# EAGLE design digital-ps (EAGLE 9.6.2)
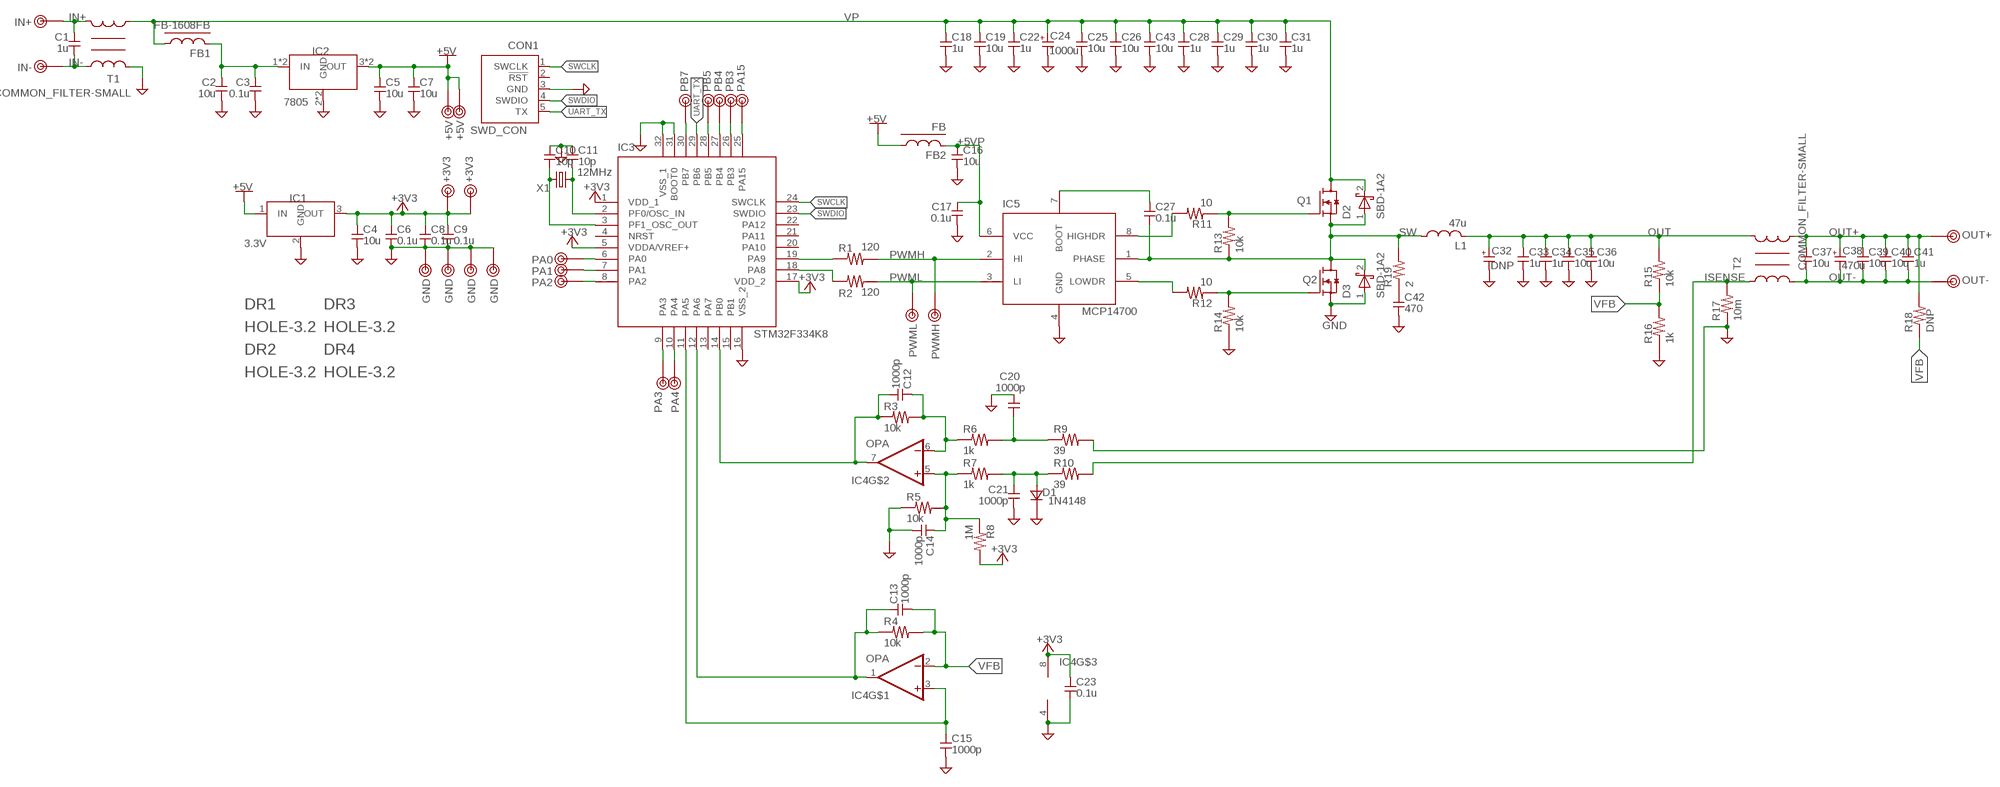
[diagram p0: schematic, sheet 1]

## Parts
C1  1u  C-2012-2  [2012-2]
C2  10u  C-3216  [3216]
C3  0.1u  C-1608  [1608]
C4  10u  C-2012  [2012]
C5  10u  C-2012  [2012]
C6  0.1u  C-1608  [1608]
C7  10u  C-2012  [2012]
C8  0.1u  C-1608  [1608]
C9  0.1u  C-1608  [1608]
C10  10p  C-1608  [1608]
C11  10p  C-1608  [1608]
C12  1000p  C-1608  [1608]
C13  1000p  C-1608  [1608]
C14  1000p  C-1608  [1608]
C15  1000p  C-1608  [1608]
C16  10u  C-2012  [2012]
C17  0.1u  C-1608  [1608]
C18  1u  C-1608-2  [1608-2]
C19  10u  C-3225-2  [3225-2]
C20  1000p  C-1608  [1608]
C21  1000p  C-1608  [1608]
C22  1u  C-1608-2  [1608-2]
C23  0.1u  C-1608  [1608]
C24  1000u  CPOLE5-13  [E5-13]
C25  10u  C-3225-2  [3225-2]
C26  10u  C-3225-2  [3225-2]
C27  0.1u  C-1608  [1608]
C28  1u  C-1608-2  [1608-2]
C29  1u  C-1608-2  [1608-2]
C30  1u  C-1608-2  [1608-2]
C31  1u  C-1608-2  [1608-2]
C32  DNP  CPOLE5-13  [E5-13]
C33  1u  C-1608-2  [1608-2]
C34  1u  C-1608-2  [1608-2]
C35  10u  C-3225-2  [3225-2]
C36  10u  C-3225-2  [3225-2]
C37  10u  C-3225-2  [3225-2]
C38  470u  CPOLE5-13  [E5-13]
C39  10u  C-3225-2  [3225-2]
C40  10u  C-3225-2  [3225-2]
C41  1u  C-1608-2  [1608-2]
C42  470  C-1608-2  [1608-2]
C43  10u  C-3225-2  [3225-2]
CON1  SWD_CON  [SWD_CON]
D1  1N4148  DIODE-1N4148W  [SOD123]
D2  SBD-1A2  [SOD123]
D3  SBD-1A2  [SOD123]
DR1  HOLE-3.2  [HOLE_3.2]
DR2  HOLE-3.2  [HOLE_3.2]
DR3  HOLE-3.2  [HOLE_3.2]
DR4  HOLE-3.2  [HOLE_3.2]
FB1  FB-1608FB  [1608-FB]
FB2  FB  [1608-J]
IC1  3.3V  78X-SOP  [P-HSIP3_2.30A]
IC2  7805  78X-3  [TO220-SOP-DUAL]
IC3  STM32F334K8  [TQFP32-08]
IC4  OPA  OPA-2-SOP  [SOP8]
IC5  MCP14700  [SOP8]
L1  47u  L-7  [L7-10]
Q1  EPC2052  NMOS-EPC2055  [EPC2055]
Q2  EPC2052  NMOS-EPC2055  [EPC2055]
R1  120  R-1608  [1608]
R2  120  R-1608  [1608]
R3  10k  R-1608  [1608]
R4  10k  R-1608  [1608]
R5  10k  R-1608  [1608]
R6  1k  R-1608  [1608]
R7  1k  R-1608  [1608]
R8  1M  R-1608  [1608]
R9  39  R-1608  [1608]
R10  39  R-1608  [1608]
R11  10  R-2012  [2012]
R12  10  R-2012  [2012]
R13  10k  R-2012  [2012]
R14  10k  R-2012  [2012]
R15  10k  R-1608  [1608]
R16  1k  R-1608  [1608]
R17  10m  R-6432  [6432]
R18  DNP  R-1608  [1608]
R19  2  R-1608-2  [1608-2]
T1  COMMON_FILTER-SMALL  [COMMON_FILTER__SMALL]
T2  COMMON_FILTER-SMALL  [COMMON_FILTER__SMALL]
TP1  PA0  TESTPIN  [TESTPIN]
TP2  PA1  TESTPIN  [TESTPIN]
TP3  PA2  TESTPIN  [TESTPIN]
TP4  PA3  TESTPIN  [TESTPIN]
TP5  IN+  TESTPIN-BIG  [TESTPIN-BIG]
TP6  IN-  TESTPIN-BIG  [TESTPIN-BIG]
TP7  OUT+  TESTPIN-BIG  [TESTPIN-BIG]
TP8  OUT-  TESTPIN-BIG  [TESTPIN-BIG]
TP9  PA4  TESTPIN  [TESTPIN]
TP10  PB7  TESTPIN  [TESTPIN]
TP11  PB5  TESTPIN  [TESTPIN]
TP15  +3V3  TESTPIN  [TESTPIN]
TP16  +5V  TESTPIN  [TESTPIN]
TP17  GND  TESTPIN  [TESTPIN]
TP18  GND  TESTPIN  [TESTPIN]
TP19  PWML  TESTPIN  [TESTPIN]
TP20  PWMH  TESTPIN  [TESTPIN]
TP21  PA15  TESTPIN  [TESTPIN]
TP22  PB3  TESTPIN  [TESTPIN]
TP23  PB4  TESTPIN  [TESTPIN]
TP24  +3V3  TESTPIN  [TESTPIN]
TP25  GND  TESTPIN  [TESTPIN]
TP26  +5V  TESTPIN  [TESTPIN]
TP27  GND  TESTPIN  [TESTPIN]
X1  12MHz  CRYSTALHC49S  [HC49/S]

## Nets
+3V3: C4.1 C6.1 C8.1 C9.1 C23.1 IC1.3(OUT) IC3.1(VDD_1) IC3.5(VDDA/VREF+) IC3.17(VDD_2) IC4.8(V+) R8.2 TP15.1 TP24.1
+5V: C5.1 C7.1 FB2.1 IC1.1(IN) IC2.3(OUT) IC2.6(OUT) TP16.1 TP26.1
+5VP: C16.1 C17.1 FB2.2 IC5.6(VCC)
GND: C2.2 C3.2 C4.2 C5.2 C6.2 C7.2 C8.2 C9.2 C10.1 C11.1 C14.2 C15.2 C16.2 C17.2 C18.2 C19.2 C20.1 C21.2 C22.2 C23.2 C24.- C25.2 C26.2 C28.2 C29.2 C30.2 C31.2 C32.- C33.2 C34.2 C35.2 C36.2 C42.2 C43.2 CON1.3(GND) D1.2(K) D3.1(A) IC1.2(GND) IC2.2(GND) IC2.5(GND) IC3.16(VSS_2) IC3.31(BOOT0) IC3.32(VSS_1) IC4.4(V-) IC5.4(GND) Q2.2(S) Q2.4(S) Q2.6(S) R5.1 R9.2 R14.1 R16.1 R17.1 T1.2 TP17.1 TP18.1 TP25.1 TP27.1
IN+: C1.1 T1.4 TP5.1
IN-: C1.2 T1.1 TP6.1
ISENSE: R10.2 R17.2 T2.1
N$1: IC3.18(PA8) R2.1
N$2: IC3.19(PA9) R1.1
N$3: C12.2 IC3.14(PB0) IC4.7(OUT) R3.1
N$4: C2.1 C3.1 FB1.2 IC2.1(IN) IC2.4(IN)
N$5: C14.1 IC4.5(+IN) R5.2 R7.1 R8.1
N$6: IC5.8(HIGHDR) R11.2
N$7: C27.1 IC5.7(BOOT)
N$8: C20.2 R6.2 R9.1
N$9: C42.1 R19.1
N$11: C21.1 D1.1(A) R7.2 R10.1
N$12: IC5.5(LOWDR) R12.2
N$13: IC3.9(PA3) TP4.1
N$14: IC3.10(PA4) TP9.1
N$15: IC3.6(PA0) TP1.1
N$16: IC3.7(PA1) TP2.1
N$17: IC3.8(PA2) TP3.1
N$18: IC3.30(PB7) TP10.1
N$19: IC3.28(PB5) TP11.1
N$23: IC3.27(PB4) TP23.1
N$24: C11.2 IC3.2(PF0/OSC_IN) X1.1
N$25: C10.2 IC3.3(PF1_OSC_OUT) X1.2
N$26: IC3.26(PB3) TP22.1
N$27: IC3.25(PA15) TP21.1
N$29: C12.1 IC4.6(-IN) R3.2 R6.1
N$30: C13.1 IC3.12(PA6) IC4.1(OUT) R4.1
N$31: C15.1 IC3.11(PA5) IC4.3(+IN)
N$32: Q1.1(G) R11.1 R13.2
N$33: Q2.1(G) R12.1 R14.2
OUT: C32.+ C33.1 C34.1 C35.1 C36.1 L1.2 R15.2 T2.4
OUT+: C37.1 C38.+ C39.1 C40.1 C41.1 R18.2 T2.3 TP7.1
OUT-: C37.2 C38.- C39.2 C40.2 C41.2 T2.2 TP8.1
PWMH: IC5.2(HI) R1.2 TP20.1
PWML: IC5.3(LI) R2.2 TP19.1
SW: C27.2 D2.1(A) D3.2(K) IC5.1(PHASE) L1.1 Q1.2(S) Q1.4(S) Q1.6(S) Q2.3(D) Q2.5(D) R13.1 R19.2
SWCLK: CON1.1(SWCLK) IC3.24(SWCLK)
SWDIO: CON1.4(SWDIO) IC3.23(SWDIO)
UART_TX: CON1.5(TX) IC3.29(PB6)
VFB: C13.2 IC4.2(-IN) R4.2 R15.1 R16.2 R18.1
VP: C18.1 C19.1 C22.1 C24.+ C25.1 C26.1 C28.1 C29.1 C30.1 C31.1 C43.1 D2.2(K) FB1.1 Q1.3(D) Q1.5(D) T1.3
Unconnected: CON1.2(!RST) IC3.4(NRST) IC3.13(PA7) IC3.15(PB1) IC3.20(PA10) IC3.21(PA11) IC3.22(PA12)

## Library data of the parts
C1-C23 C25-C31 C33-C37 C39-C43 = my_rcl:C
C24 C32 C38 = my_rcl:CPOL
CON1 = my_connector:SWD_CON
D1 = my_rcl:DIODE
D2 D3 = my_rcl:SBD
DR1-DR4 = my_connector:HOLE-3.2
FB1 FB2 = my_rcl:FB
IC1 IC2 = my_ic:78X
IC3 = my_ic:STM32F334K8
IC4 = my_ic:OPA-2
IC5 = my_ic:MCP14700
L1 = my_rcl:L
Q1 Q2 = my_ic:NMOS
R1-R19 = my_rcl:R
T1 T2 = my_rcl:COMMON_FILTER
TP1-TP11 TP15-TP27 = my_connector:TESTPIN
X1 = my_rcl:CRYSTAL: CRYSTAL

## Board
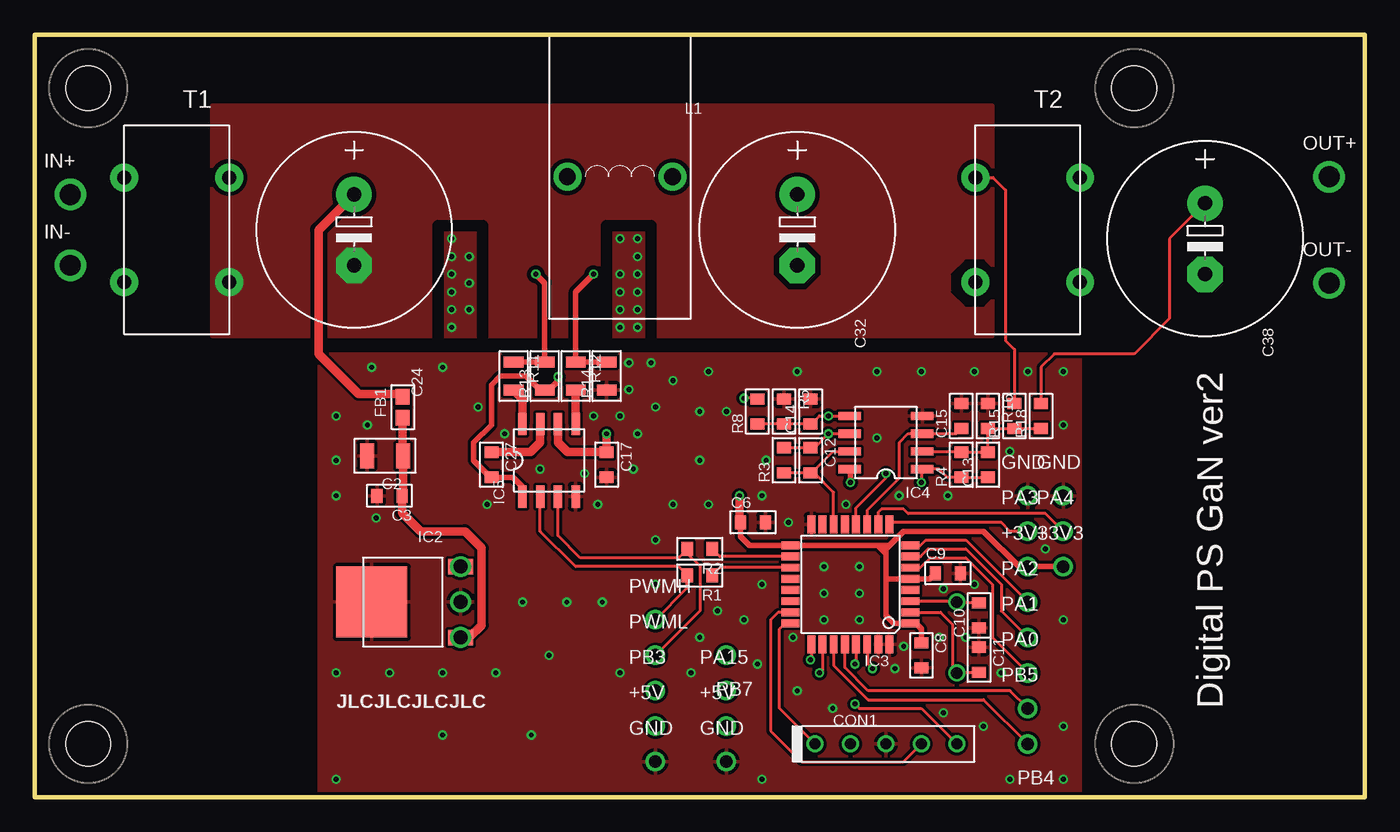
[diagram p1: board, top side]
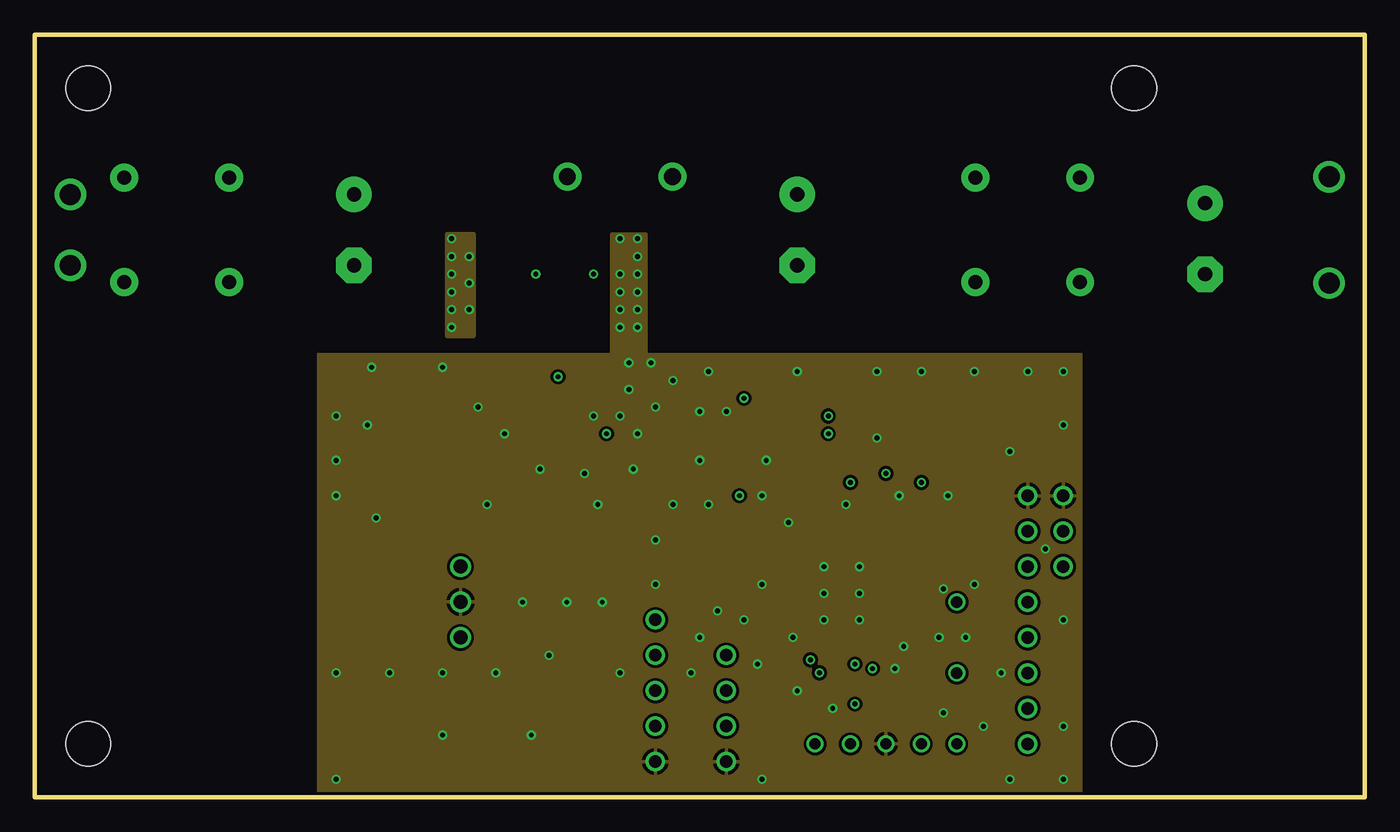
[diagram p2: board, inner layer Route2]
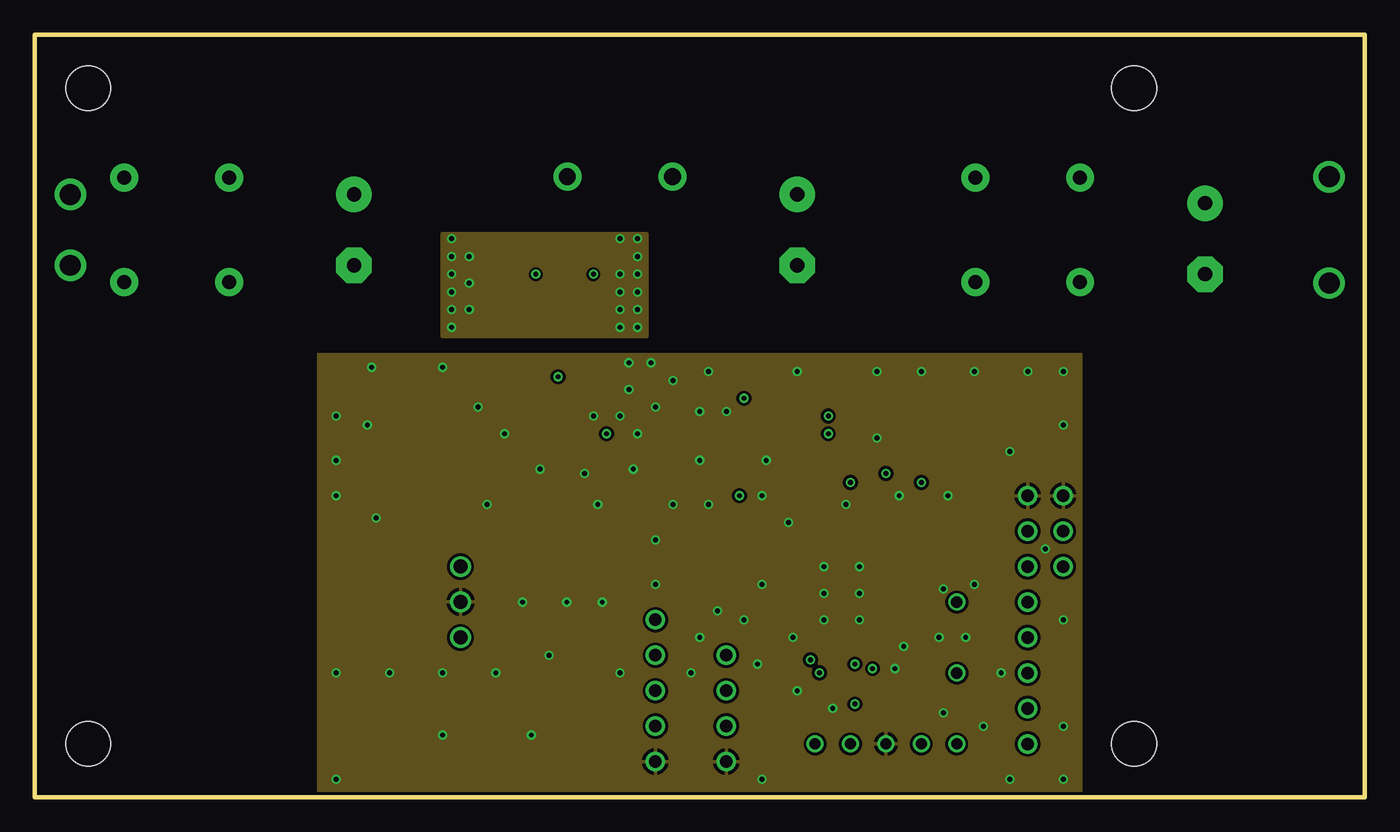
[diagram p3: board, inner layer Route15]
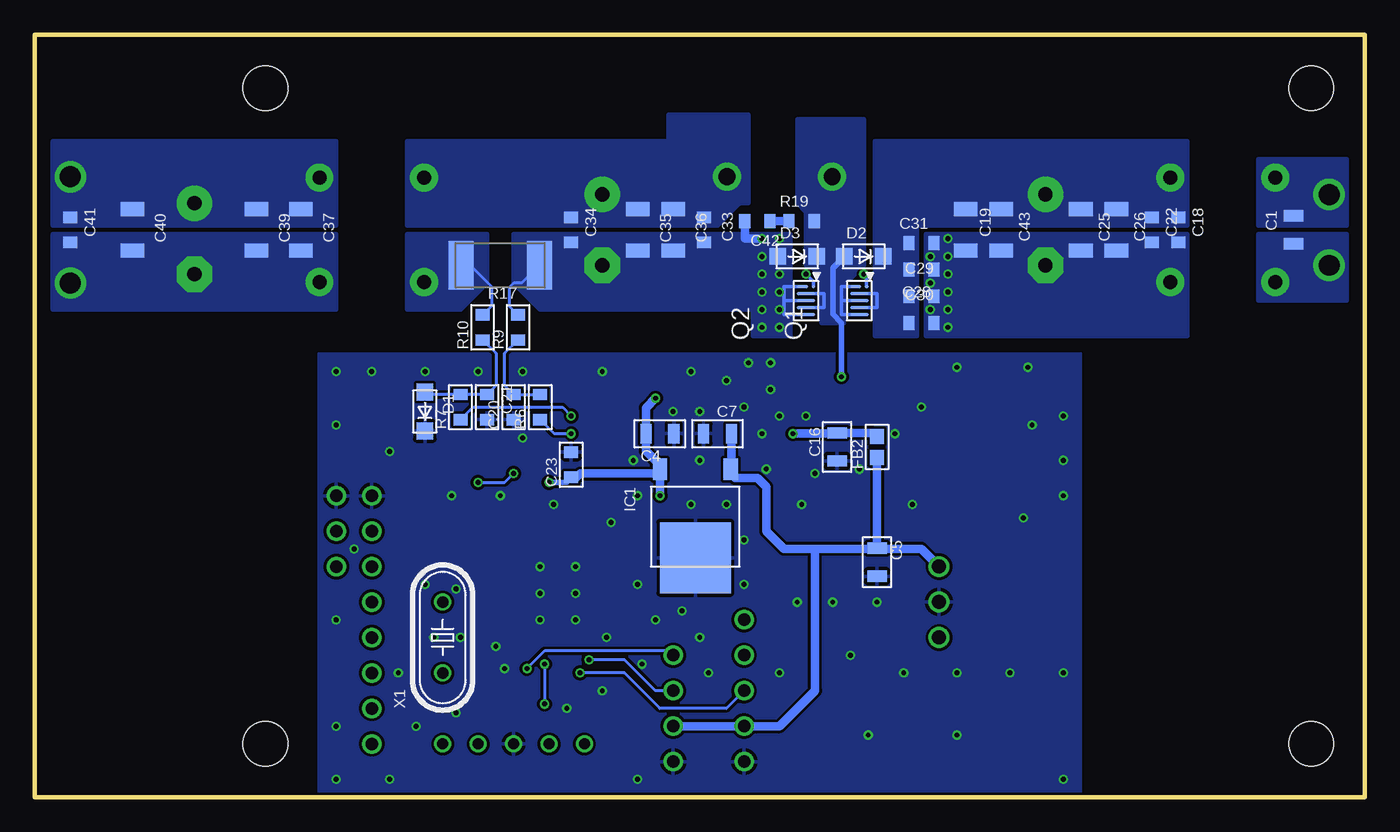
[diagram p4: board, bottom side, seen from below]

Size 95.25 x 54.61 mm. Coordinates in mm from the lower left corner, seen from the top.
Outline: 0,54.61 95.25,54.61 95.25,0 0,0 0,54.61
Copper layers (1*2*15*16): Top 0.035mm / dielectric 0.2mm / Route2 0.0175mm / dielectric 1.065mm / Route15 0.0175mm / dielectric 0.2mm / Bottom 0.035mm
Design rules "JLCPCB_4layer": minimum track width 6mil, minimum drill 0.3mm, track to track 6mil, track to pad 6mil, pad to pad 6mil, via to via 8mil, smd to smd 0mil, copper to edge 0.2mm, drill to drill 0.4mm, minimum pad ring 8mil, minimum via ring 6mil, stop-mask expansion 4mil, vias tented up to drill 1mm, thermal gap 10mil
tRestrict: 6 lines

### Footprints (pad centres in the part's own frame; a part is rotated, then mirrored left to right if it is on the bottom)
2012-2 = smd 0.8 x 1.4: 1 -1,0; 2 1,0
3216 = smd 1 x 1.8: 1 -1.3,0; 2 1.3,0
1608 = smd 0.8 x 1: 1 -0.9,0; 2 0.9,0
2012 = smd 0.8 x 1.4: 1 -1,0; 2 1,0
1608-2 = smd 0.8 x 1: 1 -0.9,0; 2 0.9,0
3225-2 = smd 1 x 1.7: 1 -1.5,0; 2 1.5,0
E5-13 = drill 1.016 pad 2.54: + -2.54,0 | drill 1.016 pad 2.54 octagon: - 2.54,0
SWD_CON = drill 0.8: 1 -5.08,0; 2 -2.54,0; 3 0,0; 4 2.54,0; 5 5.08,0
SOD123 = smd 1.2 x 1.2: 1 -1.4,0; 2 1.4,0
HOLE_3.2 = hole 3.2: 0,0
1608-FB = smd 1.1 x 1: 1 -0.75,0; 2 0.75,0
1608-J = smd 1.1 x 1: 1 -0.75,0; 2 0.75,0
P-HSIP3_2.30A = smd 1.016 x 1.524: 1 -2.54,0; 3 2.54,0 | smd 5.08 x 5.08: 2 0,6.35
TO220-SOP-DUAL = smd 1.1 x 1.8: 1 -2.54,0; 3 2.54,0 | smd 5.08 x 5.08: 2 0,6.35 | drill 1: 4 -2.54,0; 5 0,0; 6 2.54,0
TQFP32-08 = smd 1.27 x 0.559: 1 -4.293,2.8; 2 -4.293,2; 3 -4.293,1.2; 4 -4.293,0.4; 5 -4.293,-0.4; 6 -4.293,-1.2; 7 -4.293,-2; 8 -4.293,-2.8; 17 4.293,-2.8; 18 4.293,-2; 19 4.293,-1.2; 20 4.293,-0.4; 21 4.293,0.4; 22 4.293,1.2; 23 4.293,2; 24 4.293,2.8 | smd 0.559 x 1.27: 9 -2.8,-4.293; 10 -2,-4.293; 11 -1.2,-4.293; 12 -0.4,-4.293; 13 0.4,-4.293; 14 1.2,-4.293; 15 2,-4.293; 16 2.8,-4.293; 25 2.8,4.293; 26 2,4.293; 27 1.2,4.293; 28 0.4,4.293; 29 -0.4,4.293; 30 -1.2,4.293; 31 -2,4.293; 32 -2.8,4.293
SOP8 = smd 0.6 x 1.6: 1 -1.905,-2.6; 2 -0.635,-2.6; 3 0.635,-2.6; 4 1.905,-2.6; 5 1.905,2.6; 6 0.635,2.6; 7 -0.635,2.6; 8 -1.905,2.6
L7-10 = drill 1.2 pad 2: 1 -3.77,0; 2 3.77,0
EPC2055 = smd 0.26 x 0.28: 1 -1,0.525 | smd 0.26 x 0.805: 2 -1,-0.263 | smd 0.26 x 1.33: 3 -0.5,0; 4 0,0; 5 0.5,0; 6 1,0
6432 = smd 1.8 x 3.5: 1 -2.8,0; 2 2.8,0
COMMON_FILTER__SMALL = drill 1 pad 2: 1 -3.75,3.75; 2 -3.75,-3.75; 3 3.75,-3.75; 4 3.75,3.75
TESTPIN = drill 0.9 pad 1.4: 1 0,0
TESTPIN-BIG = drill 1.5: 1 0,0
HC49/S = drill 0.813: 1 -2.54,0; 2 2.54,0

### Placement (x,y rotation side)
C1  5.08,40.64 270 bottom
C2  25.08,24.45 180 top
C3  25.4,21.59 180 top
C4  50.48,26.04 0 bottom
C5  34.92,16.83 270 bottom
C6  51.44,19.68 0 top
C7  46.35,26.04 180 bottom
C8  63.5,10.16 270 top
C9  65.41,16.03 0 top
C10  67.63,13.02 90 top
C11  67.63,9.84 270 top
C12  55.56,24.13 270 top
C13  68.26,23.81 90 top
C14  55.56,27.62 90 top
C15  66.36,27.3 90 top
C16  37.78,25.08 270 bottom
C17  40.96,23.81 270 top
C18  13.34,40.64 270 bottom
C19  28.57,40.64 270 bottom
C20  60.96,27.94 90 bottom
C21  62.87,27.94 270 bottom
C22  15.24,40.64 270 bottom
C23  56.83,23.81 90 bottom
C24  22.86,40.64 270 top
C25  20.32,40.64 270 bottom
C26  17.78,40.64 270 bottom
C27  32.7,23.81 270 top
C28  31.75,37.78 0 bottom
C29  31.75,35.88 0 bottom
C30  31.75,33.97 0 bottom
C31  31.75,39.69 0 bottom
C32  54.61,40.64 270 top
C33  47.31,40.64 270 bottom
C34  56.83,40.64 270 bottom
C35  52.07,40.64 270 bottom
C36  49.53,40.64 270 bottom
C37  76.2,40.64 270 bottom
C38  83.82,40.01 270 top
C39  79.38,40.64 270 bottom
C40  88.27,40.64 270 bottom
C41  92.71,40.64 270 bottom
C42  43.5,41.27 180 bottom
C43  26.04,40.64 270 bottom
CON1  60.96,3.81 0 top
D1  67.31,27.62 270 bottom
D2  35.88,38.73 0 bottom
D3  40.64,38.73 0 bottom
DR1  3.81,3.81 0 top
DR2  3.81,50.8 0 top
DR3  78.74,3.81 0 top
DR4  78.74,50.8 0 top
FB1  26.35,27.94 270 top
FB2  34.92,25.08 90 bottom
IC1  47.94,23.5 180 bottom
IC2  30.48,13.97 90 top
IC3  58.42,15.24 180 top
IC4  60.96,25.4 90 top
IC5  36.83,24.13 0 top
L1  41.91,44.45 0 top
Q1  36.2,35.56 270 bottom
Q2  40.01,35.56 270 bottom
R1  47.62,15.88 180 top
R2  47.62,17.78 180 top
R3  53.66,24.13 90 top
R4  66.36,23.81 90 top
R5  53.66,27.62 270 top
R6  59.05,27.94 90 bottom
R7  64.77,27.94 90 bottom
R8  51.75,27.62 90 top
R9  60.64,33.66 90 bottom
R10  63.18,33.66 90 bottom
R11  34.29,30.16 270 top
R12  38.73,30.16 270 top
R13  36.51,30.16 90 top
R14  40.96,30.16 90 top
R15  70.17,27.3 90 top
R16  68.26,27.3 270 top
R17  61.91,38.1 180 bottom
R18  72.07,27.3 90 top
R19  40.32,41.27 0 bottom
T1  10.16,40.64 90 top
T2  71.12,40.64 90 top
TP1  71.12,8.89 0 top
TP2  71.12,11.43 0 top
TP3  71.12,13.97 0 top
TP4  71.12,19.05 0 top
TP5  2.54,43.18 0 top
TP6  2.54,38.1 0 top
TP7  92.71,44.45 0 top
TP8  92.71,36.83 0 top
TP9  73.66,19.05 0 top
TP10  49.53,10.16 180 top
TP11  71.12,6.35 0 top
TP15  71.12,16.51 0 top
TP16  44.45,5.08 0 top
TP17  44.45,2.54 0 top
TP18  71.12,21.59 0 top
TP19  44.45,10.16 0 top
TP20  44.45,12.7 0 top
TP21  49.53,7.62 0 top
TP22  44.45,7.62 0 top
TP23  71.12,3.81 180 top
TP24  73.66,16.51 0 top
TP25  73.66,21.59 0 top
TP26  49.53,5.08 0 top
TP27  49.53,2.54 0 top
X1  66.04,11.43 90 bottom

### Tracks (layer width: path | path; a pad name or v marks a point on that pad's centre or on a via)
+3V3  (via drill 0.35, 0.35 pad 0.55)
  Top 0.203: R8.2 51.7,28.57 v50.8,28.57
  Top 0.406: 61.22,18.04 62.23,19.05 67.94,19.05 70.48,16.51 TP15.1 TP24.1 | C6.1 50.53,18.68 51.17,18.04 IC3.17 60.33,18.04 | 60.33,18.04 60.64,18.04 60.96,18.04 | C8.1 63.5,12.06 63.12,12.44 IC3.1 61.54,12.44 60.96,13.02 60.96,15.56 | C9.1 64.11,15.64 IC3.5 61.04,15.64 60.96,15.56 | 60.96,18.04 61.22,18.04 | 60.96,15.56 60.96,17.46 | 60.96,17.46 60.96,17.78 | 60.96,18.04 60.96,17.78 | 61.22,18.04 60.96,17.78 | 60.33,18.04 60.38,18.04 60.96,17.46 | IC4.8 58.42,23.43 v58.42,22.54
  Top 0.61: C6.1 50.48,19.74 v50.48,21.59
  Bottom 0.406: v58.42,22.54 57.2,22.54 C23.1
  Bottom 0.61: IC1.3 50.48,23.81 51.48,24.81 C4.1 51.48,27.89 v50.8,28.57 | IC1.3 v50.48,21.59 | IC1.3 50.8,23.18 51.44,23.18 56.2,23.18 56.46,22.91 C23.1
+5V
  Bottom 0.61: C7.1 45.35,24.77 45.35,23.81 45.4,23.77 IC1.1 45.4,23.18 45.09,22.86 43.5,22.86 42.86,22.23 42.86,19.05 41.59,17.78 39.37,17.78 | IC2.6 31.75,17.78 34.88,17.78 C5.1 | FB2.1 C5.1 | C5.1 34.97,17.78 39.37,17.78 | 39.37,17.78 39.37,7.62 41.91,5.08 TP16.1 TP26.1
+5VP  (via drill 0.35)
  Top 0.61: IC5.6 37.47,25.4 38.15,24.71 C17.1 40.96,25.66 v40.96,26.04
  Bottom 0.61: v40.96,26.04 37.83,26.04 C16.1 35.17,26.08 FB2.2
GND  (via drill 0.35, 0.35 pad 0.55)
  Bottom 0.203: R17.1 60.38,36.83 60.96,36.83 61.28,36.51 61.28,35.19 R9.2
  Bottom 0.254: Q2.2 41.59,36.56 41.59,35.56 | 41.59,35.56 41.59,34.56 Q2.6 | Q2.4 41.59,35.56
  Bottom 0.61: C42.2 44.4,40.01 v43.18,40.01
  other vias: 53.98,19.68 48.9,13.34 36.2,23.5 40.32,20.95 39.37,23.18 40.01,27.3 52.07,1.27 69.85,1.27 73.66,5.08 73.66,12.7 73.66,26.67 69.85,24.77 41.91,27.3 56.52,14.61 54.29,11.43 64.77,11.43 66.67,11.43 62.23,10.79 69.22,8.89 61.59,9.21 67.31,15.24 65.09,14.92 54.61,7.62 46.99,8.89 47.62,11.43 41.91,8.89 48.26,20.95 44.45,18.41 44.45,15.24 47.62,24.13 47.62,27.62 67.94,5.08 21.59,27.3 21.59,1.27 21.59,8.89 42.55,29.21 56.52,16.51 59.05,16.51 59.05,14.61 56.52,12.7 59.05,12.7 49.53,27.62 42.86,23.5 43.18,26.04 29.21,30.8 42.55,31.11 31.75,27.94 32.38,20.95 21.59,24.13 23.81,26.67 21.59,21.59 24.45,20 35.56,4.45 33.02,8.89 29.21,4.45 25.4,8.89 45.72,20.95 29.21,8.89 34.92,13.97 38.1,13.97 40.64,13.97 36.83,10.16 73.66,1.27 73.66,30.48 67.31,30.48 63.5,30.48 60.33,30.48 54.61,30.48 60.33,25.72 58.1,20.95 61.91,21.59 52.39,24.13 44.45,27.94 65.41,21.59 48.26,30.48 33.66,26.04 72.39,17.78 52.07,21.59 57.15,6.35 65.09,6.03 52.07,15.24 50.8,12.7 51.75,9.53 43.18,33.66 41.91,36.2 41.91,34.92 43.18,36.2 41.91,33.66 43.18,37.47 43.18,38.73 31.11,38.73 31.11,36.83 29.84,36.2 29.84,34.92 29.84,37.47 29.84,38.73 29.84,33.66 29.84,40.01 31.11,34.92 43.18,34.92 44.13,31.11 45.72,29.84 41.91,37.47 24.13,30.8 71.12,30.48 41.91,40.01
  pour Top (isolate 0.203): 74.93,31.75 20.32,31.75 20.32,0 74.93,0
  pour Bottom (isolate 0.203): 20.32,31.75 74.93,31.75 74.93,0 20.32,0
  cutout Top (isolate 0.203): 53.98,39.69 53.02,38.73 53.02,37.47 53.98,36.51 55.24,36.51 56.2,37.47 56.2,38.73 55.24,39.69
  pour Bottom (no thermals): 12.7,40.32 31.43,40.32 31.43,33.02 12.7,33.02
  pour Bottom (no thermals): 43.81,40.32 60.96,40.32 60.96,36.83 59.05,34.92 43.81,34.92
  pour Route15 (no thermals): 29.21,40.32 43.81,40.32 43.81,33.02 29.21,33.02
  pour Route15 (isolate 0.203): 20.32,31.75 74.93,31.75 74.93,0 20.32,0
  pour Route2 (isolate 0.203): 20.32,0 20.32,31.75 74.93,31.75 74.93,0
  pour Route2 (isolate 0.305): 43.81,40.32 41.27,40.32 41.27,31.75 43.81,31.75
  pour Top (isolate 0.305, no thermals): 12.7,33.02 12.7,49.53 68.58,49.53 68.58,33.02
  cutout Top (isolate 0.203): 66.67,38.42 65.72,37.47 65.72,36.2 66.67,35.24 67.94,35.24 68.9,36.2 68.9,37.47 67.94,38.42
  pour Route2 (no thermals): 29.53,40.32 31.43,40.32 31.43,33.02 29.53,33.02
  pour Bottom (no thermals): 41.12,33.02 41.12,40.32 43.81,40.32 43.81,33.02
IN+
  pour Bottom (isolate 0.305, no thermals): 1.27,40.96 7.62,40.96 7.62,45.72 1.27,45.72
IN-
  pour Bottom (isolate 0.305, no thermals): 1.27,40.32 7.62,40.32 7.62,35.56 1.27,35.56
ISENSE
  Bottom 0.203: R17.2 64.08,38.1 62.55,36.57 62.55,35.88 62.55,35.19 R10.2
  pour Bottom (no thermals): 62.87,40.32 62.87,36.83 64.77,34.92 68.58,34.92 68.58,40.32
N$1
  Top 0.203: IC3.18 49.06,17.24 R2.1
N$2
  Top 0.203: IC3.19 49.09,16.44 R1.1
N$3
  Top 0.203: IC3.14 57.22,21.84 55.83,23.23 C12.2 | C12.2 R3.1 | C12.2 55.62,23.23 57.15,24.77 IC4.7
N$4
  Top 0.61: FB1.2 26.35,24.48 C2.1 26.38,21.67 C3.1 26.3,20.37 27.62,19.05 30.8,19.05 32,17.85 32,12.32 31.11,11.43 IC2.4
N$5  (via drill 0.35)
  Top 0.203: 56.52,27.3 56.2,27.3 55.88,26.99 55.83,26.99 C14.1 R5.2 R8.1 | 56.52,27.3 IC4.5 | v56.83,27.3 56.52,27.3
  Bottom 0.203: R7.1 63.87,27.94 57.47,27.94 v56.83,27.3
N$6
  Top 0.61: R11.2 34.92,28.53 IC5.8
N$7
  Top 0.61: C27.1 35.51,24.71 36.2,25.4 IC5.7
N$8
  Bottom 0.203: R6.2 C20.2 61.59,29.48 61.59,31.8 R9.1
N$9
  Bottom 0.61: R19.1 C42.1
N$11
  Bottom 0.203: R10.1 62.23,31.8 62.23,29.48 C21.1 R7.2 67.13,28.84 D1.1
N$12
  Top 0.61: IC5.5 R12.2
N$13
  Top 0.203: IC3.9 61.22,19.68 69.22,19.68 69.85,19.05 TP4.1
N$14
  Top 0.203: IC3.10 60.42,20.41 60.64,20.64 62.23,20.64 62.55,20.32 72.39,20.32 TP9.1
N$15
  Top 0.203: TP1.1 68.58,11.43 68.58,15.24 66.67,17.14 64.14,17.14 63.43,16.44 IC3.6
N$16
  Top 0.203: TP2.1 69.22,13.34 69.22,15.24 66.67,17.78 63.98,17.78 63.44,17.24 IC3.7
N$17
  Top 0.203: IC3.8 63.44,18.04 63.82,18.41 66.67,18.41 TP3.1
N$18  (via drill 0.35)
  Top 0.203: IC3.30 59.62,9.6 v60.01,9.21
  Bottom 0.203: v60.01,9.21 59.05,10.16 58.74,10.48 49.85,10.48 TP10.1
N$19
  Top 0.203: TP11.1 69.85,7.62 59.69,7.62 58.02,9.29 IC3.28
N$23
  Top 0.203: IC3.27 57.22,9.46 59.69,6.99 67.94,6.99 TP23.1
N$24
  Top 0.203: C11.2 67.58,8.89 X1.1 65.72,9.21 65.72,12.38 64.86,13.24 IC3.2
N$25
  Top 0.203: C10.2 66.09,13.92 X1.2 65.97,14.04 IC3.3
N$26  (via drill 0.35)
  Top 0.203: IC3.26 56.42,9.11 v56.2,8.89
  Bottom 0.203: TP22.1 45.72,6.35 50.48,6.35 53.02,8.89 v56.2,8.89
N$27  (via drill 0.35)
  Top 0.203: IC3.25 55.62,9.9 v55.56,9.84
  Bottom 0.203: v55.56,9.84 53.02,9.84 50.8,7.62 TP21.1
N$29  (via drill 0.35)
  Top 0.203: R3.2 C12.1 55.83,25.03 v56.83,26.04 IC4.6
  Bottom 0.203: R6.1 58.05,26.04 v56.83,26.04
N$30  (via drill 0.35)
  Top 0.203: C13.1 R4.1 65.35,22.91 64.77,23.5 IC4.1 63.5,23.43 v63.5,22.54 | IC3.12 58.82,20.72 60.96,22.86 v60.96,23.18
  Bottom 0.203: v63.5,22.54 61.59,22.54 v60.96,23.18
N$31
  Top 0.203: IC3.11 59.62,20.57 61.91,22.86 61.91,25.4 62.55,26.04 IC4.3 65.99,26.04 C15.1
N$32  (via drill 0.35)
  Top 0.406: R11.1 R13.2 36.51,36.83 v35.88,37.47
  Bottom 0.254: Q1.1 35.67,37.26 v35.88,37.47
N$33  (via drill 0.35)
  Top 0.406: R14.2 R12.1 38.73,36.2 v40.01,37.47
  Bottom 0.254: Q2.1 39.48,36.94 v40.01,37.47
OUT
  Top 0.203: R15.2 70.17,32.07 69.53,32.7 69.53,34.61 69.53,43.5 68.64,44.39 T2.4
  pour Bottom (no thermals): 46.67,46.99 46.67,40.96 68.58,40.96 68.58,46.99
  pour Bottom (no thermals): 44.13,42.55 44.13,48.9 49.85,48.9 49.85,40.96 46.35,40.96 44.77,42.55
OUT+
  Top 0.203: R18.2 72.1,28.23 72.07,28.26 72.07,30.8 73.03,31.75 78.74,31.75 81.28,34.29 81.28,40.01 C38.+
  pour Bottom (no thermals): 93.98,40.96 73.66,40.96 73.66,46.99 93.98,46.99
OUT-
  pour Bottom (no thermals): 73.66,40.32 73.66,34.92 93.98,34.92 93.98,40.32
PWMH
  Top 0.203: IC5.2 36.2,19.05 38.73,16.51 46.09,16.51 R1.2 46.73,14.97 TP20.1
PWML
  Top 0.203: IC5.3 37.47,18.73 39.05,17.14 46.09,17.14 R2.2 46.73,17.46 47.62,16.56 47.62,13.34 TP19.1
SW  (via drill 0.35)
  Top 0.406: v37.47,30.11 37.47,29.8 36.83,29.16 R13.1 36.2,29.16 35.2,30.16 33.34,30.16 32.7,29.53 32.7,26.67 31.43,25.4 31.43,24.13 32.65,22.91 C27.2 34.24,22.91 34.92,22.23 IC5.1
  Bottom 0.254: Q2.3 38.73,36.06 38.73,35.06 Q2.5 | Q1.2 37.47,36.56 37.47,35.56 | 37.47,35.56 37.47,34.56 Q1.6 | Q1.4 37.47,35.56
  Bottom 0.406: v37.47,30.11 37.47,33.97 38.1,34.61 38.1,37.91 D2.1
  pour Bottom (no thermals): 37.31,37.15 37.31,33.97 38.89,33.97 38.89,37.15
  pour Bottom (no thermals): 39.05,37.15 36.83,37.15 35.88,38.1 35.88,48.58 40.64,48.58 40.64,42.55 40.01,41.91 40.01,38.1
SWCLK
  Top 0.203: CON1.1 53.34,6.35 53.34,12.06 53.72,12.44 IC3.24
SWDIO
  Top 0.203: IC3.23 53.24,13.24 52.7,12.7 52.7,4.76 54.93,2.54 62.23,2.54 CON1.4
UART_TX  (via drill 0.35)
  Top 0.203: IC3.29 58.82,9.61 v58.74,9.53 | v58.74,6.67 59.05,6.35 63.5,6.35 CON1.5
  Bottom 0.203: v58.74,9.53 v58.74,6.67
VFB
  Top 0.203: IC4.2 66.31,24.77 R4.2 C13.2 R16.2 R15.1 R18.1
VP
  Top 0.61: FB1.1 26.15,28.89 23.18,28.89 20.32,31.75 20.32,40.64 C24.+
  Bottom 0.254: Q1.3 34.92,36.06 34.92,35.06 Q1.5
  pour Bottom (no thermals): 12.7,40.96 12.7,46.99 35.08,46.99 35.08,33.02 32.07,33.02 32.07,40.96

### Text on the board
tPlace: JLCJLCJLCJLC | Digital PS GaN ver2